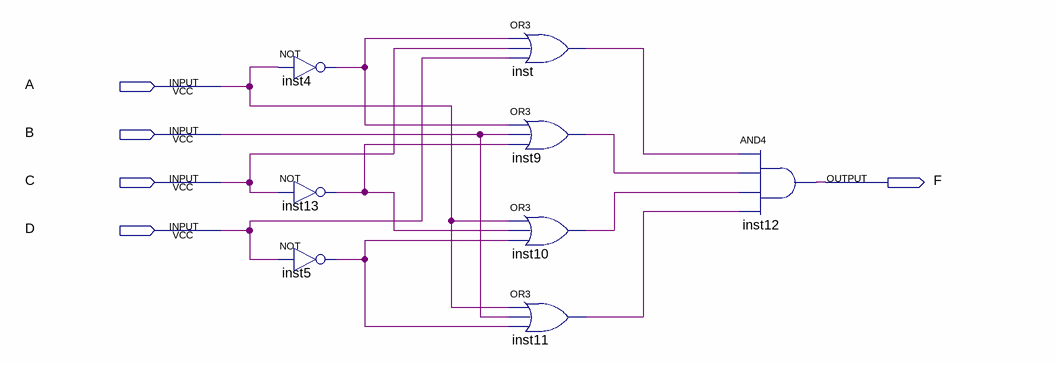
[diagram p0: schematic sheet]
// Quartus schematic part2_realistic.bdf as structural Verilog: 8 symbols, 5 pins
module part2_realistic (
  input  A,
  input  B,
  input  C,
  input  D,
  output F
);

  wire inst4_out, inst5_out, inst9_out, inst10_out, inst11_out, inst13_out, inst_out;

  not inst4 (inst4_out, A);
  not inst13 (inst13_out, C);
  not inst5 (inst5_out, D);
  or inst (inst_out, inst4_out, C, D);
  or inst9 (inst9_out, inst4_out, B, inst13_out);
  or inst10 (inst10_out, A, inst13_out, inst5_out);
  or inst11 (inst11_out, A, B, inst5_out);
  and inst12 (F, inst_out, inst9_out, inst10_out, inst11_out);
endmodule
